# Altium project 011_BPD_Arduino_Shield.PrjPcb
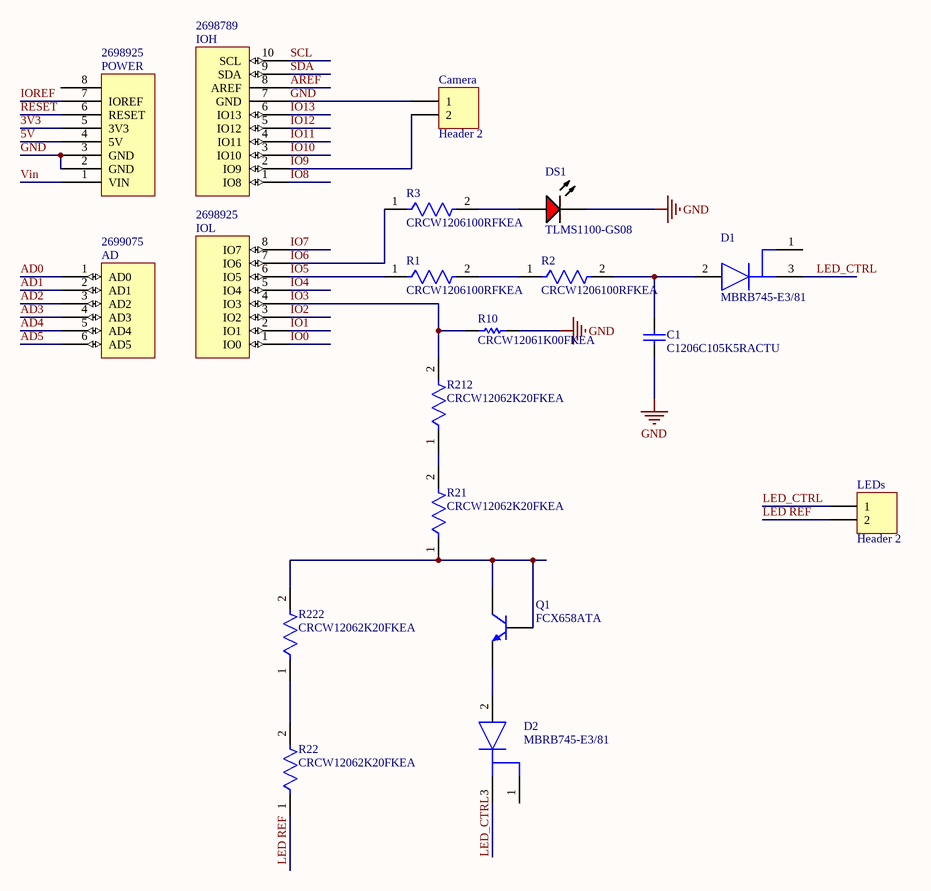
[diagram p0: 011_BPD_Arduino_Shield.SchDoc]
1 sheet, 19 parts. Net scope: global (net labels, ports and power ports of the same name join across sheets).
Board file: 011_BPD_Arduino_Shield.PcbDoc

## Sheet 011_BPD_Arduino_Shield.SchDoc
size A4; SheetNumber: 1; SheetTotal: 1

### Parts
AD  Supplier Part Number 4: 2699075  [Header 6x1 8.5mm]  (hidden comment: AD)
C1  C1206C105K5RACTU  [CAPC3216X110X50LL20T25]
Camera  Header 2  [HDR1X2]
D1  MBRB745-E3/81  [FP-MBRB745-E3-81-MFG]
D2  MBRB745-E3/81  [FP-MBRB745-E3-81-MFG]
DS1  TLMS1100-GS08  [VISH-TLMX1100_V]
IOH  Supplier Part Number 3: 2698789  [Header 10x1 8.5mm]  (hidden comment: IOH)
IOL  Supplier Part Number 4: 2698925  [Header 8x1 8.5mm]  (hidden comment: IOL)
LEDs  Header 2  [HDR1X2]
POWER  Supplier Part Number 4: 2698925  [Header 8x1 8.5mm]  (hidden comment: POWER_UNO)
Q1  FCX658ATA  [DIOD-SOT89-3_V]
R1  CRCW1206100RFKEA  [FP-CRCW1206-e3-MFG]
R2  CRCW1206100RFKEA  [FP-CRCW1206-e3-MFG]
R3  CRCW1206100RFKEA  [FP-CRCW1206-e3-MFG]
R10  CRCW12061K00FKEA  [RESC3216X60X45ML15T20]
R21  CRCW12062K20FKEA  [FP-CRCW1206-e3-IPC_C]
R22  CRCW12062K20FKEA  [FP-CRCW1206-e3-IPC_C]
R212  CRCW12062K20FKEA  [FP-CRCW1206-e3-IPC_C]
R222  CRCW12062K20FKEA  [FP-CRCW1206-e3-IPC_C]

### Nets
GND: C1.1 Camera.1 DS1.2(K) IOH.7(GND) POWER.2(GND) POWER.3(GND) R10.2
3V3: POWER.5(3V3)
5V: POWER.4(5V)
AD0: AD.1(AD0)
AD1: AD.2(AD1)
AD2: AD.3(AD2)
AD3: AD.4(AD3)
AD4: AD.5(AD4)
AD5: AD.6(AD5)
AREF: IOH.8(AREF)
IO0: IOL.1(IO0)
IO1: IOL.2(IO1)
IO2: IOL.3(IO2)
IO3: IOL.4(IO3) R10.1 R212.2
IO4: IOL.5(IO4)
IO5: IOL.6(IO5) R1.1
IO6: IOL.7(IO6) R3.1
IO7: IOL.8(IO7)
IO8: IOH.1(IO8)
IO9: Camera.2 IOH.2(IO9)
IO10: IOH.3(IO10)
IO11: IOH.4(IO11)
IO12: IOH.5(IO12)
IO13: IOH.6(IO13)
IOREF: POWER.7(IOREF)
LED REF: LEDs.2 R22.1
LED_CTRL: D1.3(C) D2.3(C) LEDs.1
RESET: POWER.6(RESET)
SCL: IOH.10(SCL)
SDA: IOH.9(SDA)
Vin: POWER.1(VIN)
NetC1_2: C1.2 D1.2(A) R2.2
NetD2_2: D2.2(A) Q1.3(E)
NetDS1_1: DS1.1(A) R3.2
NetQ1_1: Q1.1(B) Q1.2(C) R21.1 R222.2
NetR1_2: R1.2 R2.1
NetR21_2: R21.2 R212.1
NetR22_2: R22.2 R222.1

Not connected (* = marked no-connect by the designer): D1 1(C); D2 1(C); POWER 8

### Library data of the parts
C1 = CMP-2000-06011-1: Chip Capacitor, 1 uF, +/- 10%, 50 V, -55 to 125 degC, 1206 (3216 Metric), RoHS, Tape and Reel; Manufacturer: Kemet; Case Height: 1mm; Dielectric: X7R; Voltage Rating: 50V; Capacitance: 1uF; Temperature Coefficient / Code: +/-15%; Case Length: 3.2mm; Case Width: 1.6mm; Type: SMDMLCCX7R6.3-250VDCCommericalGrade; Class: Class1; Capacitance - nF: 1000nF; Datasheet URL: http://www.kemet.com/docfinder?Partnumber=C1206C105K5RACTU; Product Category: MultilayerCeramicCapacitorsMLCC-SMD/SMT; Termination Style: SMD/SMT; Dimensions: 1.6mmWx3.2mmLx1mmH; Voltage Rating DC: 50V; Datasheet Version: 02/2016; Packaging: Reel; Brand: Kemet; RoHS: Details; Minimum Operating Temperature: -55C; Operating Temperature Range: -55Cto+125C; Package Reference: 1206; Manufacturer URL: http://www.kemet.com/; Product: GeneralTypeMLCCs; Tolerance: 10%; Package Description: 2-Pin Surface Mount Device, Body 3.2 x 1.6 mm; Mounting Technology: SurfaceMount; Case Code - mm: 3216; Maximum Operating Temperature: +125C; Series: C1206C; Factory Pack Quantity: 2500; Package / Case: 1206(3216metric); Case Code - in: 1206
Camera LEDs = Header 2: Header, 2-Pin; LatestRevisionDate: 17-Jul-2002; LatestRevisionNote: Re-released for DXP Platform.; Publisher: Altium Limited
D1 D2 = CMP-02539-000024-1: DIODE SCHOTTKY 45V 7.5A TO263AB; Manufacturer: Vishay; Max Surge Forward Current: 150A; Peak Reverse Current: 0.1mA; Standoff Height: 0mm; Max Junction Temp: +150°C; Automotive Grade: NA; Forward Current: 7.5A; Device Class L2: Diodes; RoHS: TRUE; Temperature: -65°C to +150°C; Digikey Description: DIODE SCHOTTKY 45V 7.5A TO263AB; Temperature Range Low: -65°C; Octopart: https://octopart.com/mbrb745-e3%2F81-vishay-42182719; Temperature Range High: +150°C; Manufacturer Part Number: MBRB745-E3/81; Package: MBRB745-E3/81; Category: Diode; Max Repetitive Reverse Voltage: 45V; ComponentLink2Description: Datasheet; ComponentLink2URL: https://www.vishay.com/docs/87594/mbrb7xx.pdf; Automotive: No; Height: 5.084mm; Device Class L3: Schottky Diodes; Reverse Voltage: 45V; Device Class L1: Discrete Semiconductors; Lead Free: Yes; Mouser Description: Diode Schottky 45V 7.5A 3-Pin(2+Tab) D2PAK T/R
DS1 = CMP-1666-00027-1: LED, RED, 2.1 V, -40 to 100 degC, 2-Pin SMD (0603), RoHS, Tape and Reel; Type (Capacitors): C0G; Resistance: 100000000000 Ohm; Capacitance: 12 pF; Voltage Rating: 50 V; Tolerance: 5%; Min Operating Temperature: -55degC; REACH SVHC: No SVHC; ComponentLink2Description: Datasheet; ComponentLink1URL: http://www.vishay.com/; Width: 0.8 mm; Package Quantity: 4000; PackageReference: TLMX1100; ComponentLink2URL: http://www.vishay.com/docs/83173/tlmb1100.pdf; Case/Package: 0603; Case Code (Metric): 1608; Packaging: Tape and Reel; Pins: 2; ComponentLink1Description: Manufacturer URL; Max Operating Temperature: 125degC; Height: 0.8 mm; Length: 1.6 mm; Mount: Surface Mount; PackageDescription: 2-Pin Surface Mount Device, Body 1.6 x 0.8 mm; DatasheetVersion: Rev. 2.7, 03/2016; Case Code (Imperial): 0603; Voltage Rating (DC): 50 V; RoHSCompliant: True; Radiation Hardening: No
Q1 = CMP-0906-00001-1: NPN Silicon Planar Medium Power High Voltage Transistor, 400 V VCEO, 1W, -55 to 150 degC, 3-Pin SOT89, RoHS; Manufacturer: Diodes Inc; FT: 50 MHz; IC: 0.5 A; VCE (Sat): 200 mV Max.; ICM: 1 A; VCEO: 400 V; DatasheetVersion: Nov-00; ComponentLink1Description: Manufacturer URL; ComponentLink3URL: http://diodes.com/_files/zetex_files/pack/SOT89.pdf; ComponentLink3Description: Package Specification; RoHS: TRUE; ComponentLink2URL: http://diodes.com/datasheets/FCX658A.pdf; PD: 1 W; ComponentLink1URL: http://diodes.com/; Temperature Range: -55 to 150 degC; Mounting Technology: Surface Mount; PartNumber: FCX658ATA; ComponentLink2Description: Datasheet; PackageDescription: 3-Pin SOT89, Body 4.5 x 2.445 mm, Pitch 1.5 mm; PackageReference: SOT89; PackageVersion: Mar-07
R1-R3 = CMP-2003-04801-2: RES Thick Film, 100Ω, 1%, 0.25W, 100ppm/°C, 1206; Voltage Rating (DC): 200V; Resistance: 100R; Power Rating: 250mW; Case Code (Metric): 3216; Radiation Hardening: No; Height: 0.55mm; Packaging: Tape and Reel; Depth: 1.6mm; Weight: 0.000353oz; Termination: SMD/SMT; Lead Free: Lead Free; Min Operating Temperature: -55°C; Contact Plating: Tin; Max Operating Temperature: 155°C; Case Code (Imperial): 1206; Military Standard: Not; Width: 1.6mm; Number of Pins: 2; Voltage Rating: 200V; Composition: Thick Film; Package Quantity: 5000; Tolerance: 1%; Case/Package: 1206; Mount: Surface Mount; Length: 3.2mm; Temperature Coefficient: 100ppm/°C
R10 = CMP-2100-03616-1: Chip Resistor, 1 KOhm, +/- 1%, 0.25 W, -55 to 155 degC, 1206 (3216 Metric), RoHS, Tape and Reel; Manufacturer: Vishay Semiconductor; Power Rating: 250mW; Voltage Rating (DC): 200V; Resistance: 1KOhm; Temperature Coefficient: 100ppm/degreesC; Case Code (Imperial): 1206; Length: 3.2mm; Case/Package: 1206; Contact Plating: Tin; Package Quantity: 10; Datasheet URL: http://www.farnell.com/datasheets/1720486.pdf; Mount: SurfaceMount; Package Description: 2-Pin Surface Mount Device, Body 3.15 x 1.6 mm; Package Reference: 1206.0; Max Operating Temperature: 155degC; Lead Free: LeadFree; Weight: 0.000353oz; Military Standard: Not; Max Power Dissipation: 250mW; Case Code (Metric): 3216; Number of Terminations: 2; Tolerance: 1%; Width: 0.063inch; Termination: SMD/SMT; Number of Pins: 2; Min Operating Temperature: -55degC; Height: 0.55mm; Depth: 1.6mm; RoHSCompliant: true; Composition: ThickFilm; Packaging: TapeandReel; Manufacturer URL: http://www.vishay.com/; Voltage Rating: 200V; Radiation Hardening: No; REACH SVHC: Unknown; Datasheet Version: 41061.0
R21 R22 R212 R222 = CMP-2003-02034-2: RES Thick Film, 1kΩ, 1%, 0.25W, 100ppm/°C, 1206; Voltage Rating: 200V; Max Power Dissipation: 250mW; Resistance: 2.2kR; Voltage Rating (DC): 200V; Depth: 1.6mm; Max Operating Temperature: 155°C; Width: 1.6mm; Packaging: Tape and Reel; Min Operating Temperature: -55°C; Military Standard: Not; Weight: 0.000353oz; Package Quantity: 10; Case Code (Metric): 3216; Length: 3.2mm; Lead Free: Lead Free; Case/Package: 1206; Number of Terminations: 2; Temperature Coefficient: 100ppm/°C; Case Code (Imperial): 1206; Power Rating: 250mW; Contact Plating: Tin; Composition: Thick Film; Features: Automotive AEC-Q200; Termination: SMD/SMT; Height: 0.55mm; Tolerance: 1%; Radiation Hardening: No
AD = AD: Supplier 1: Arrow; Supplier Part Number 1: 2699089; Supplier 2: Digi-Key; Supplier Part Number 2: SAM1198-06-ND; Supplier 3: Arrow; Supplier Part Number 3: 2699088; Supplier 4: Arrow
IOH = IOH: Supplier 1: Arrow; Supplier Part Number 1: 2698803S4475693N1004; Supplier 2: Digi-Key; Supplier Part Number 2: SAM1198-10-ND; Supplier 3: Arrow
IOL = IOL: Supplier 1: Digi-Key; Supplier Part Number 1: SAM1198-08-ND; Supplier 2: Arrow; Supplier Part Number 2: 2698939; Supplier 3: Arrow; Supplier Part Number 3: 2698940; Supplier 4: Arrow
POWER = POWER_UNO: Supplier 1: Digi-Key; Supplier Part Number 1: SAM1198-08-ND; Supplier 2: Arrow; Supplier Part Number 2: 2698939; Supplier 3: Arrow; Supplier Part Number 3: 2698940; Supplier 4: Arrow